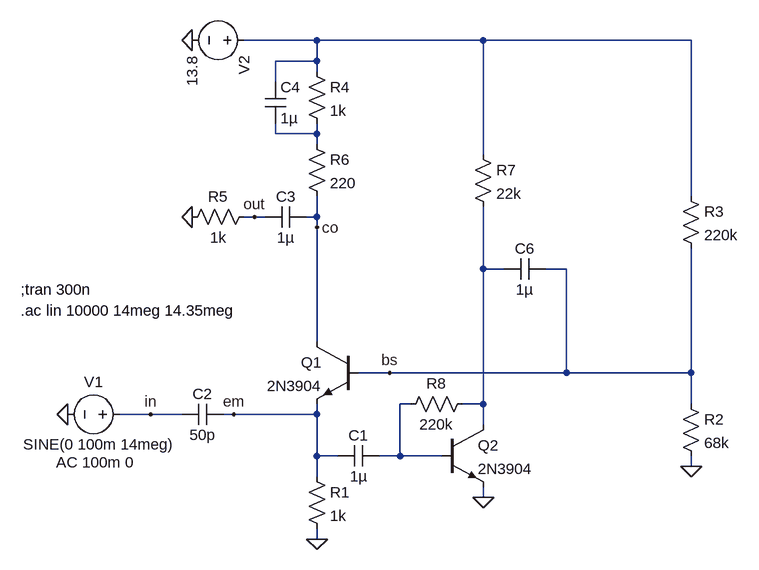
[diagram p0: schematic pll-shifter.asc]
pll-shifter.asc, the LTspice schematic file:
Version 4
SHEET 1 920 680
WIRE 224 -320 112 -320
WIRE 480 -320 224 -320
WIRE 800 -320 480 -320
WIRE 224 -288 224 -320
WIRE 224 -288 160 -288
WIRE 224 -272 224 -288
WIRE 160 -256 160 -288
WIRE 160 -176 160 -192
WIRE 224 -176 224 -192
WIRE 224 -176 160 -176
WIRE 224 -160 224 -176
WIRE 480 -144 480 -320
WIRE 800 -80 800 -320
WIRE 128 -48 112 -48
WIRE 144 -48 128 -48
WIRE 224 -48 224 -80
WIRE 224 -48 208 -48
WIRE 224 -32 224 -48
WIRE 480 32 480 -64
WIRE 512 32 480 32
WIRE 608 32 576 32
WIRE 224 144 224 -32
WIRE 336 192 288 192
WIRE 608 192 608 32
WIRE 608 192 336 192
WIRE 800 192 800 0
WIRE 800 192 608 192
WIRE 368 240 352 240
WIRE 480 240 480 32
WIRE 480 240 448 240
WIRE 800 240 800 192
WIRE -32 256 -80 256
WIRE 16 256 -32 256
WIRE 96 256 80 256
WIRE 224 256 224 240
WIRE 224 256 96 256
WIRE 480 272 480 240
WIRE 224 320 224 256
WIRE 256 320 224 320
WIRE 352 320 352 240
WIRE 352 320 320 320
WIRE 416 320 352 320
WIRE 800 336 800 320
WIRE 224 352 224 320
WIRE 480 384 480 368
WIRE 224 448 224 432
FLAG -160 256 0
FLAG 224 448 0
FLAG 32 -320 0
FLAG -32 256 in
FLAG 96 256 em
FLAG 32 -48 0
FLAG 224 -32 co
FLAG 128 -48 out
FLAG 336 192 bs
FLAG 800 336 0
FLAG 480 384 0
SYMBOL voltage -64 256 R90
WINDOW 0 -50 41 VRight 2
WINDOW 3 46 -70 VRight 2
WINDOW 123 74 -7 VRight 2
WINDOW 39 0 0 Left 0
SYMATTR InstName V1
SYMATTR Value SINE(0 100m 14meg)
SYMATTR Value2 AC 100m 0
SYMBOL npn 288 144 M0
SYMATTR InstName Q1
SYMATTR Value 2N3904
SYMBOL res 208 336 R0
SYMATTR InstName R1
SYMATTR Value 1k
SYMBOL res 784 224 R0
SYMATTR InstName R2
SYMATTR Value 68k
SYMBOL res 784 -96 R0
SYMATTR InstName R3
SYMATTR Value 220k
SYMBOL voltage 128 -320 R90
WINDOW 123 0 0 Left 0
WINDOW 39 0 0 Left 0
SYMATTR InstName V2
SYMATTR Value 13.8
SYMBOL cap 80 240 R90
WINDOW 0 0 32 VBottom 2
WINDOW 3 32 32 VTop 2
SYMATTR InstName C2
SYMATTR Value 50p
SYMBOL cap 208 -64 R90
WINDOW 0 0 32 VBottom 2
WINDOW 3 32 32 VTop 2
SYMATTR InstName C3
SYMATTR Value 1µ
SYMBOL res 128 -64 R90
WINDOW 0 0 56 VBottom 2
WINDOW 3 32 56 VTop 2
SYMATTR InstName R5
SYMATTR Value 1k
SYMBOL res 208 -176 R0
SYMATTR InstName R6
SYMATTR Value 220
SYMBOL cap 144 -256 R0
SYMATTR InstName C4
SYMATTR Value 1µ
SYMBOL npn 416 272 R0
SYMATTR InstName Q2
SYMATTR Value 2N3904
SYMBOL res 464 -160 R0
SYMATTR InstName R7
SYMATTR Value 22k
SYMBOL cap 320 304 R90
WINDOW 0 0 32 VBottom 2
WINDOW 3 32 32 VTop 2
SYMATTR InstName C1
SYMATTR Value 1µ
SYMBOL cap 576 16 R90
WINDOW 0 0 32 VBottom 2
WINDOW 3 32 32 VTop 2
SYMATTR InstName C6
SYMATTR Value 1µ
SYMBOL res 464 224 R90
WINDOW 0 0 56 VBottom 2
WINDOW 3 32 56 VTop 2
SYMATTR InstName R8
SYMATTR Value 220k
SYMBOL res 208 -288 R0
SYMATTR InstName R4
SYMATTR Value 1k
TEXT -232 96 Left 2 !.ac lin 10000 14meg 14.35meg
TEXT -232 64 Left 2 !;tran 300n

The netlist it stands for:
* pll-shifter.asc
V1 in 0 SINE(0 100m 14meg) AC 100m 0
Q1 co bs em 0 2N3904
R1 em 0 1k
R2 bs 0 68k
R3 N001 bs 220k
V2 N001 0 13.8
C2 em in 50p
C3 co out 1µ
R5 out 0 1k
R6 N002 co 220
C4 N001 N002 1µ
Q2 N003 N004 0 0 2N3904
R7 N001 N003 22k
C1 N004 em 1µ
C6 bs N003 1µ
R8 N003 N004 220k
R4 N001 N002 1k
.model NPN NPN
.model PNP PNP
.lib standard.bjt
.ac lin 10000 14meg 14.35meg
;tran 300n
.backanno
.end